# EAGLE design csp_v1 (EAGLE 7.6.0)
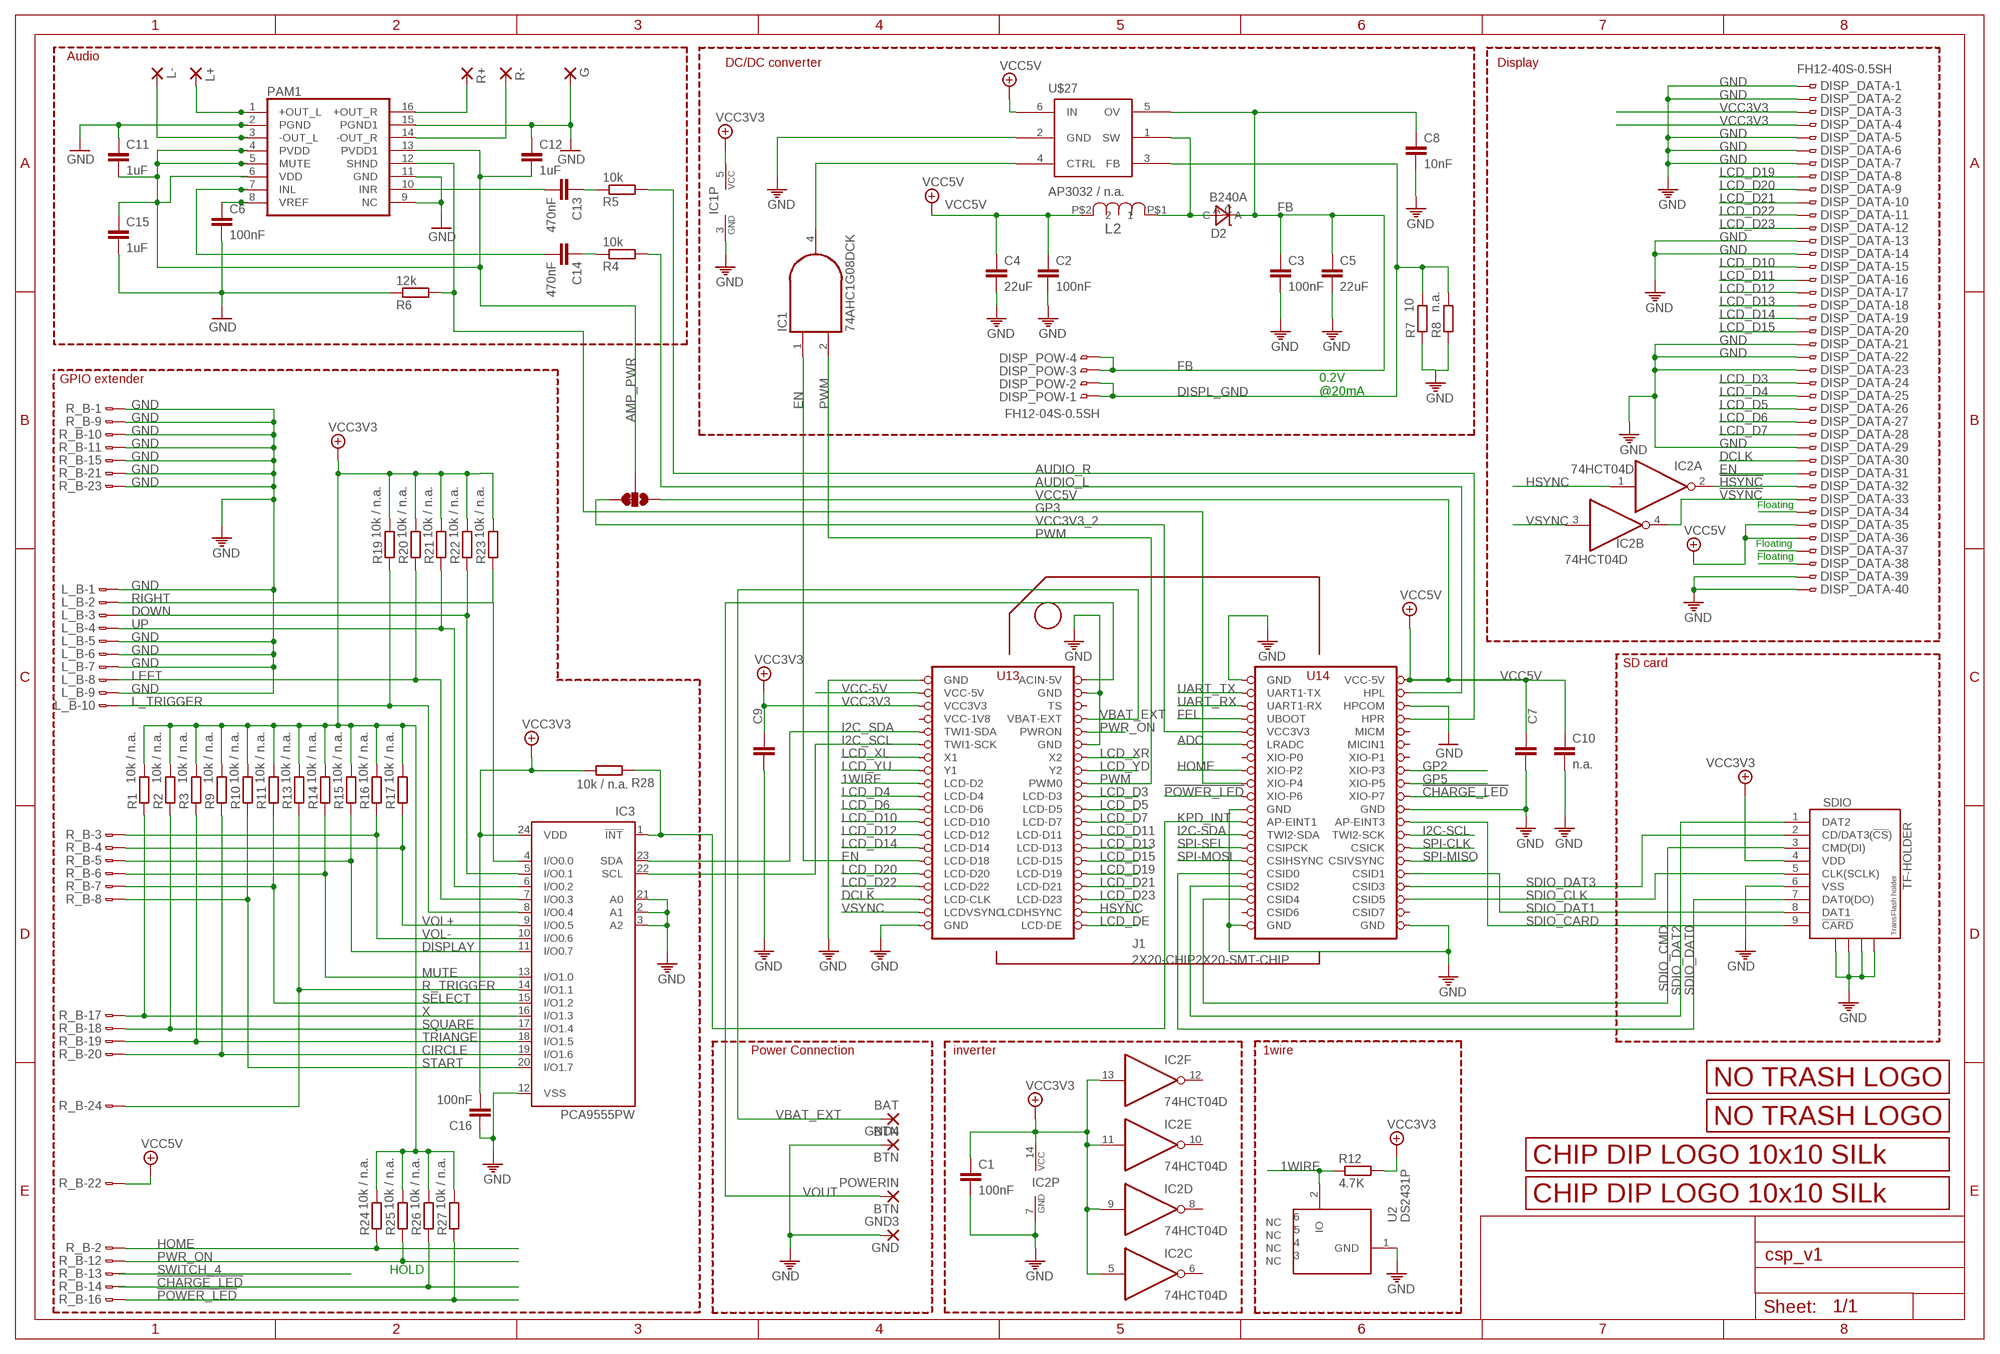
[diagram p0: schematic, sheet 1]

## Parts
BAT  BTN  SMD2  [SMD1,27-2,54]
C1  100nF  C-EUC0805  [C0805]
C2  100nF  C-EUC0805  [C0805]
C3  100nF  C-EUC0805  [C0805]
C4  22uF  C-EUC1206  [C1206]
C5  22uF  C-EUC1206  [C1206]
C6  100nF  C-EUC0805  [C0805]
C7  n.a.  C-EUC0805  [C0805]
C8  10nF  C-EUC0805  [C0805]
C9  n.a.  C-EUC0805  [C0805]
C10  n.a.  C-EUC0805  [C0805]
C11  1uF  C-EUC0805  [C0805]
C12  1uF  C-EUC0805  [C0805]
C13  470nF  C-EUC0805  [C0805]
C14  470nF  C-EUC0805  [C0805]
C15  1uF  C-EUC0805  [C0805]
C16  100nF  C-EUC0805  [C0805]
D2  B240A  DIODE_SCHTKY_B240  [DO-214AC]
DISP_DATA  FH12-40S-0.5SH  [FH12-40S-0.5SH]
DISP_POW  FH12-04S-0.5SH  [FH12-04S-0.5SH]
G  1,6/0,8  [1,6/0,8]
GND3  GND  SMD2  [SMD1,27-2,54]
GND4  BTN  SMD2  [SMD1,27-2,54]
IC1  74AHC1G08DCK  [SC70-5]
IC2  74HCT04D  [SO14]
IC3  PCA9555PW  [TSSOP24]
J1  2X20-CHIP2X20-SMT-CHIP  [2XAWHW40_G_SMD_R]
L2  SRN6045-100M  [SRN6045]
L+  1,6/0,8  [1,6/0,8]
L-  1,6/0,8  [1,6/0,8]
L_B  FH12-10S-0.5SH  [FH12-10S-0.5SH]
PAM1  PAM8403  [SOP-16]
POWERIN  BTN  SMD2  [SMD1,27-2,54]
R1  10k / n.a.  R-EU_M0805  [M0805]
R2  10k / n.a.  R-EU_M0805  [M0805]
R3  10k / n.a.  R-EU_M0805  [M0805]
R4  10k  R-EU_R0805  [R0805]
R5  10k  R-EU_R0805  [R0805]
R6  12k  R-EU_R0805  [R0805]
R7  10  R-EU_M0805  [M0805]
R8  n.a.  R-EU_M0805  [M0805]
R9  10k / n.a.  R-EU_M0805  [M0805]
R10  10k / n.a.  R-EU_M0805  [M0805]
R11  10k / n.a.  R-EU_M0805  [M0805]
R12  4.7K  R-EU_M0805  [M0805]
R13  10k / n.a.  R-EU_M0805  [M0805]
R14  10k / n.a.  R-EU_M0805  [M0805]
R15  10k / n.a.  R-EU_M0805  [M0805]
R16  10k / n.a.  R-EU_M0805  [M0805]
R17  10k / n.a.  R-EU_M0805  [M0805]
R19  10k / n.a.  R-EU_M0805  [M0805]
R20  10k / n.a.  R-EU_M0805  [M0805]
R21  10k / n.a.  R-EU_M0805  [M0805]
R22  10k / n.a.  R-EU_M0805  [M0805]
R23  10k / n.a.  R-EU_M0805  [M0805]
R24  10k / n.a.  R-EU_M0805  [M0805]
R25  10k / n.a.  R-EU_M0805  [M0805]
R26  10k / n.a.  R-EU_M0805  [M0805]
R27  10k / n.a.  R-EU_M0805  [M0805]
R28  10k / n.a.  R-EU_M0805  [M0805]
R+  1,6/0,8  [1,6/0,8]
R-  1,6/0,8  [1,6/0,8]
R_B  FH12-24S-0.5SH  [FH12-24S-0.5SH]
SDIO  TF-HOLDER  [TF-PULL]
SJ3  SMD_SJ_3WAY_CLOSED  [SMD_SJ_3WAY_CLOSED]
U2  DS2431P  [TSOC6]
U$2  LOGO_10X10_SILK  [LOGO2_10X10_SILK]
U$3  LOGO_NO_TRASHROHS  [LOGO_ROHS_SYM]
U$4  LOGO_NO_TRASHNO_TRASH  [LOGO_ROHS_NO_TRASH]
U$5  LOGO_10X10_SILK  [LOGO2_10X10_SILK]
U$27  AP3032 / n.a.  AP3032  [SOT23-6]

## Nets
1WIRE: J1.LCD-D2 R12.1 U2.2(IO)
!CHARGE_LED: J1.XIO-P7 R26.1 R_B.14
!HSYNC: DISP_DATA.32 IC2.2(A:O)
!POWER_LED: J1.XIO-P6 R27.1 R_B.16
!VSYNC: DISP_DATA.33 IC2.4(B:O)
ADC: J1.LRADC
AMP_PWR: C11.2 C12.2 C15.1 PAM1.4(PVDD) PAM1.5(MUTE) PAM1.6(VDD) PAM1.13(PVDD1) SJ3.2
AUDIO_L: J1.HPL R4.2
AUDIO_R: J1.HPR R5.2
CIRCLE: IC3.19(I/O1.6) R9.1 R_B.20
DCLK: DISP_DATA.30 J1.LCD-CLK
DISPL_GND: DISP_POW.1 DISP_POW.2 R7.2 R8.2 U$27.3(FB)
DISPLAY: IC3.11(I/O0.7) R15.1 R_B.5
DOWN: IC3.5(I/O0.1) L_B.3 R22.1
EN: DISP_DATA.31 IC1.1(I0) J1.LCD-D18
FB: C3.1 C5.1 C8.1 D2.C DISP_POW.3 DISP_POW.4 U$27.5(OV)
FEL: J1.FEL(UBOOT)
GND: C1.2 C2.2 C3.2 C4.2 C5.2 C6.2 C7.2 C8.2 C9.2 C10.2 C11.1 C12.1 C15.2 C16.1 DISP_DATA.1 DISP_DATA.2 DISP_DATA.5 DISP_DATA.6 DISP_DATA.7 DISP_DATA.13 DISP_DATA.14 DISP_DATA.21 DISP_DATA.22 DISP_DATA.23 DISP_DATA.29 DISP_DATA.39 DISP_DATA.40 G.1(P) GND3.1(P) GND4.1(P) IC1.3(GND) IC2.7(P:GND) IC3.2(A1) IC3.3(A2) IC3.12(VSS) IC3.21(A0) J1.GND@1(GND) J1.GND@2(GND) J1.GND@3(GND) J1.GND@4(GND) J1.GND@5(GND) J1.GND@6(GND) J1.GND@7(GND) J1.GND@8(GND) J1.GND@10(GND) J1.HPCOM L_B.1 L_B.5 L_B.6 L_B.7 L_B.9 PAM1.2(PGND) PAM1.9(NC) PAM1.11(GND) PAM1.15(PGND1) R6.1 R7.1 R8.1 R_B.1 R_B.9 R_B.10 R_B.11 R_B.15 R_B.21 R_B.23 SDIO.6(VSS) SDIO.S1 SDIO.S2 SDIO.S3 SDIO.S4 U2.1(GND) U$27.2(GND)
GP2: J1.XIO-P3
GP3: J1.XIO-P4 PAM1.12(SHND) R6.2
GP5: J1.XIO-P5
HOME: J1.XIO-P2 R24.1 R_B.2
HSYNC: IC2.1(A:I) J1.LCD-HSYNC(LCDHSYNC)
I2C-SCL: J1.TWI2-SCK
I2C-SDA: J1.TWI2-SDA
I2C_SCL: IC3.22(SCL) J1.TWI1-SCK
I2C_SDA: IC3.23(SDA) J1.TWI1-SDA
INL: C14.2 PAM1.7(INL)
INR: C13.2 PAM1.10(INR)
KPD_INT: IC3.1(!INT) J1.AP-EINT1 R28.1
L+OUT: L+.1(P) PAM1.1(+OUT_L)
L-OUT: L-.1(P) PAM1.3(-OUT_L)
L_TRIGGER: IC3.8(I/O0.4) L_B.10 R19.1
LCD_D3: DISP_DATA.24 J1.LCD-D3
LCD_D4: DISP_DATA.25 J1.LCD-D4
LCD_D5: DISP_DATA.26 J1.LCD-D5
LCD_D6: DISP_DATA.27 J1.LCD-D6
LCD_D7: DISP_DATA.28 J1.LCD-D7
LCD_D10: DISP_DATA.15 J1.LCD-D10
LCD_D11: DISP_DATA.16 J1.LCD-D11
LCD_D12: DISP_DATA.17 J1.LCD-D12
LCD_D13: DISP_DATA.18 J1.LCD-D13
LCD_D14: DISP_DATA.19 J1.LCD-D14
LCD_D15: DISP_DATA.20 J1.LCD-D15
LCD_D19: DISP_DATA.8 J1.LCD-D19
LCD_D20: DISP_DATA.9 J1.LCD-D20
LCD_D21: DISP_DATA.10 J1.LCD-D21
LCD_D22: DISP_DATA.11 J1.LCD-D22
LCD_D23: DISP_DATA.12 J1.LCD-D23
LCD_DE: J1.LCD-DE
LCD_XL: J1.X1
LCD_XR: J1.X2
LCD_YD: J1.Y2
LCD_YU: J1.Y1
LEFT: IC3.7(I/O0.3) L_B.8 R20.1
MUTE: IC3.13(I/O1.0) R14.1 R_B.6
N$1: IC1.4(O) U$27.4(CTRL)
N$9: DISP_DATA.38
N$24: DISP_DATA.37
N$25: DISP_DATA.34
N$38: C6.1 PAM1.8(VREF)
N$41: C14.1 R4.1
N$43: C13.1 R5.1
PWM: IC1.2(I1) J1.PWM0
PWR_ON: J1.PWRON R25.1 R_B.12
R+OUT: PAM1.16(+OUT_R) R+.1(P)
R-OUT: PAM1.14(-OUT_R) R-.1(P)
R_TRIGGER: IC3.14(I/O1.1) R13.1 R_B.24
RIGHT: IC3.4(I/O0.0) L_B.2 R23.1
SDIO_CARD: J1.AP-EINT3 SDIO.9(!CARD)
SDIO_CLK: J1.CSID5 SDIO.5(CLK(SCLK))
SDIO_CMD: J1.CISD4(CSID4) SDIO.3(CMD(DI))
SDIO_DAT0: J1.CSID0 SDIO.7(DAT0(DO))
SDIO_DAT1: J1.CSID1 SDIO.8(DAT1)
SDIO_DAT2: J1.CSID2 SDIO.1(DAT2)
SDIO_DAT3: J1.CSID3 SDIO.2(CD/DAT3(!CS!))
SELECT: IC3.15(I/O1.2) R11.1 R_B.7
SPI-CLK: J1.CSICK
SPI-MISO: J1.CSIVSYNC
SPI-MOSI: J1.CSIHYSYNC(CSIHSYNC)
SPI-SEL: J1.CSPICK(CSIPCK)
SQUARE: IC3.17(I/O1.4) R2.1 R_B.18
START: IC3.20(I/O1.7) R10.1 R_B.8
SWITCH_4: R_B.13
TRIANGE: IC3.18(I/O1.5) R3.1 R_B.19
UART_RX: J1.UART1-RX
UART_TX: J1.UART1-TX
UP: IC3.6(I/O0.2) L_B.4 R21.1
VBAT_EXT: BAT.1(P) J1.BAT(VBAT-EXT)
VCC3V3: C1.1 C9.1 C16.2 DISP_DATA.3 DISP_DATA.4 IC1.5(VCC) IC2.5(C:I) IC2.9(D:I) IC2.11(E:I) IC2.13(F:I) IC2.14(P:VCC) IC3.24(VDD) J1.VCC3V3@2(VCC3V3) R1.2 R2.2 R3.2 R9.2 R10.2 R11.2 R12.2 R13.2 R14.2 R15.2 R16.2 R17.2 R19.2 R20.2 R21.2 R22.2 R23.2 R24.2 R25.2 R26.2 R27.2 R28.2 SDIO.4(VDD)
VCC3V3_2: J1.VCC3V3@1(VCC3V3) SJ3.1
VCC5V: C2.1 C4.1 C7.1 C10.1 DISP_DATA.35 DISP_DATA.36 J1.VCC-5V@2(VCC-5V) L2.P$2 R_B.22 SJ3.3 U$27.6(IN)
VCC-5V: J1.VCC-5V@1(VCC-5V)
VOL+: IC3.9(I/O0.5) R17.1 R_B.4
VOL-: IC3.10(I/O0.6) R16.1 R_B.3
VOUT: J1.CHG-IN(ACIN-5V) POWERIN.1(P)
VREG_OUTPUT: D2.A L2.P$1 U$27.1(SW)
VSYNC: IC2.3(B:I) J1.LCD-VSYNC(LCDVSYNC)
X: IC3.16(I/O1.3) R1.1 R_B.17
Unconnected: IC2.6(C:O) IC2.8(D:O) IC2.10(E:O) IC2.12(F:O) J1.CSID6 J1.CSID7 J1.MICIN1 J1.MICM J1.TS J1.XIO-P0 J1.XIO-P1 U2.3(NC) U2.4(NC) U2.5(NC) U2.6(NC)

## Notes on the sheet
- Audio
- DC/DC converter | Display
- GPIO extender
- 0.2V
  @20mA
- Floating
- Floating
- Floating
- SD card
- Power Connection | inverter | 1wire
- HOLD

## Power pins joined to a net without a drawn wire
VCC-1V8: J1.VCC1V8(VCC-1V8)

## Library data of the parts
BAT GND3 GND4 POWERIN = wirepad:SMD2: SMD PAD
C1-C16 = rcl:C-EU: CAPACITOR, European symbol
D2 = Keyboard v0_5:DIODE_SCHTKY_B240; DESCRIPTION: DIODE SMD General Purpose 400V 1A 1.4W RoHS DO-214AC; FOOTPRINT: DO-214AC; LINK: http://www.digikey.com/product-detail/en/B240A-13-F/B240A-FDICT-ND/717810; MFG: DIGIKEY; MFG_PN: B240A-FDICT-ND; PART_TYPE: DIODE; PRICE: 0.11; VENDOR: DIODES; VENDOR_PART_NUMBER: B240A-13-F
DISP_DATA = Keyboard v0_5:FH12-40S-0.5S: 0.5mm Pitch Connectors For FPC/FFC Source: Data sheet <http://www.hirose.co.jp/cataloge_hp/e58605370.pdf>; DESCRIPTION: CON ffc smd, bottom contact 40pos, 0.50mm R/A; FOOTPRINT: FH12-40S-0.5SH; LINK: http://www.digikey.com/product-detail/en/FH12-40S-0.5SH(55)/HFJ140CT-ND/1110388; MFG: DIGIKEY; MFG_PN: HFJ140CT-ND; VENDOR: HIROSE; VENDOR_PART_NUMBER: FH12-40S-0.5SH(55)
DISP_POW = JKW_CHIP:FH12-04S-0.5S: 0.5mm Pitch Connectors For FPC/FFC Source: Data sheet <http://www.hirose.co.jp/cataloge_hp/e58605370.pdf>; MPN: FH12-10S-0.5SH(55); OC_FARNELL: 1324540; OC_NEWARK: 34M6152
G L+ L- R+ R- = wirepad:1,6/0,8: THROUGH-HOLE PAD
IC1 = 74xx-little-us:74*1G08: 2-input AND gate
IC2 = JKW_CHIP:74*04: Hex INVERTER
IC3 = micro-philips:PCA9555: 16-bit I2C and SMBus I/O port with interrupt Source: PCA9555_5.pdf; MPN: PCA9555PW; OC_FARNELL: 1408297; OC_NEWARK: 63K6069
J1 = JKW_CHIP:2X20-CHIP: Chip header
L2 = Keyboard v0_5:SRN6045-100M; DESCRIPTION: power inductor 10uH 2.5A 58.6 mohm; FOOTPRINT: SRN6045; LINK: http://www.digikey.com/product-detail/en/SRN6045-100M/SRN6045-100MTR-ND/2756120; MFG: DIGIKEY; MFG_PN: SRN6045-100MTR-ND; PART_TYPE: IND; PRICE: 0.15; TOLLERANCE: ±20%; VENDOR: BOURNS; VENDOR_PART_NUMBER: SRN6045-100M
L_B = con-hirose:FH12-10S-0.5S: 0.5mm Pitch Connectors For FPC/FFC Source: Data sheet <http://www.hirose.co.jp/cataloge_hp/e58605370.pdf>; MPN: FH12-10S-0.5SH(55); OC_FARNELL: 1324540; OC_NEWARK: 34M6152
PAM1 = JKW_CHIP:PAM8403: Dual channel audio amplifier IC - PAM8403
R1-R17 R19-R28 = rcl:R-EU_: RESISTOR, European symbol
R_B = con-hirose:FH12-24S-0.5S: 0.5mm Pitch Connectors For FPC/FFC Source: Data sheet <http://www.hirose.co.jp/cataloge_hp/e58605370.pdf>; MPN: FH12-24S-0.5SH(55); OC_FARNELL: 1324552; OC_NEWARK: 34M6170
SDIO = JKW_CHIP:TF-HOLDER: TF / Micro SD socket is PUSH-PUSH type, the card can be pushed into and auto locked and pushed out by simply press the card. Surface Mounting type.
SJ3 = JKW_CHIP:SMD_SJ_3WAY_CLOSED
U2 = JKW_CHIP:DS2431: 1024-Bit EEPROM This chip provides a 4x256 Bit EEPROM, which can be programmed@5V. Write protection and OTP emulation are available, too. Author: Jan Kandziora <jjj@gmx.de>; DESCRIPTION: IC, 1024-Bit, 1-Wire EEPROM, TSOC6; FOOTPRINT: TSOC6; LINK: http://www.digikey.com/product-detail/en/DS2431P%2BT%26R/DS2431P%2BT%26RCT-ND/3647900; MFG: DIGIKEY; MFG_PN: DS2431P+T&RCT-ND; PART_TYPE: IC; PRICE: 0.98; VENDOR: MAXIM; VENDOR_PART_NUMBER: DS2431P+T&R
U$2 U$5 = JKW_CHIP:LOGO_10X10_SILK
U$3 U$4 = JKW_CHIP:LOGO_NO_TRASH
U$27 = JKW_CHIP:AP3032

## Board
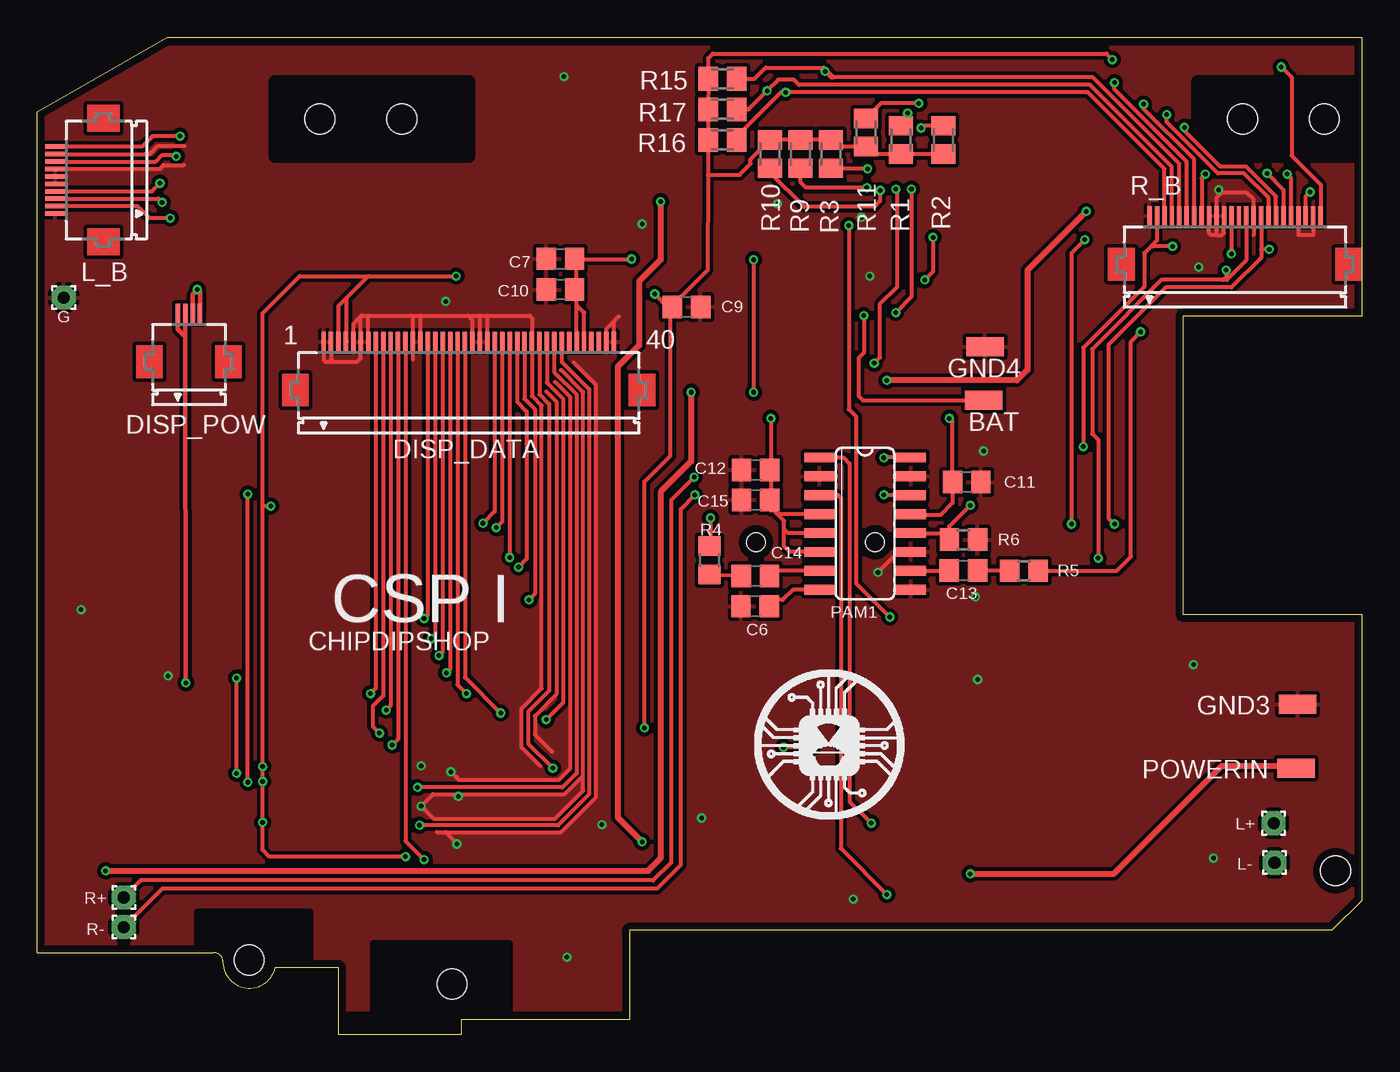
[diagram p1: board, top side]
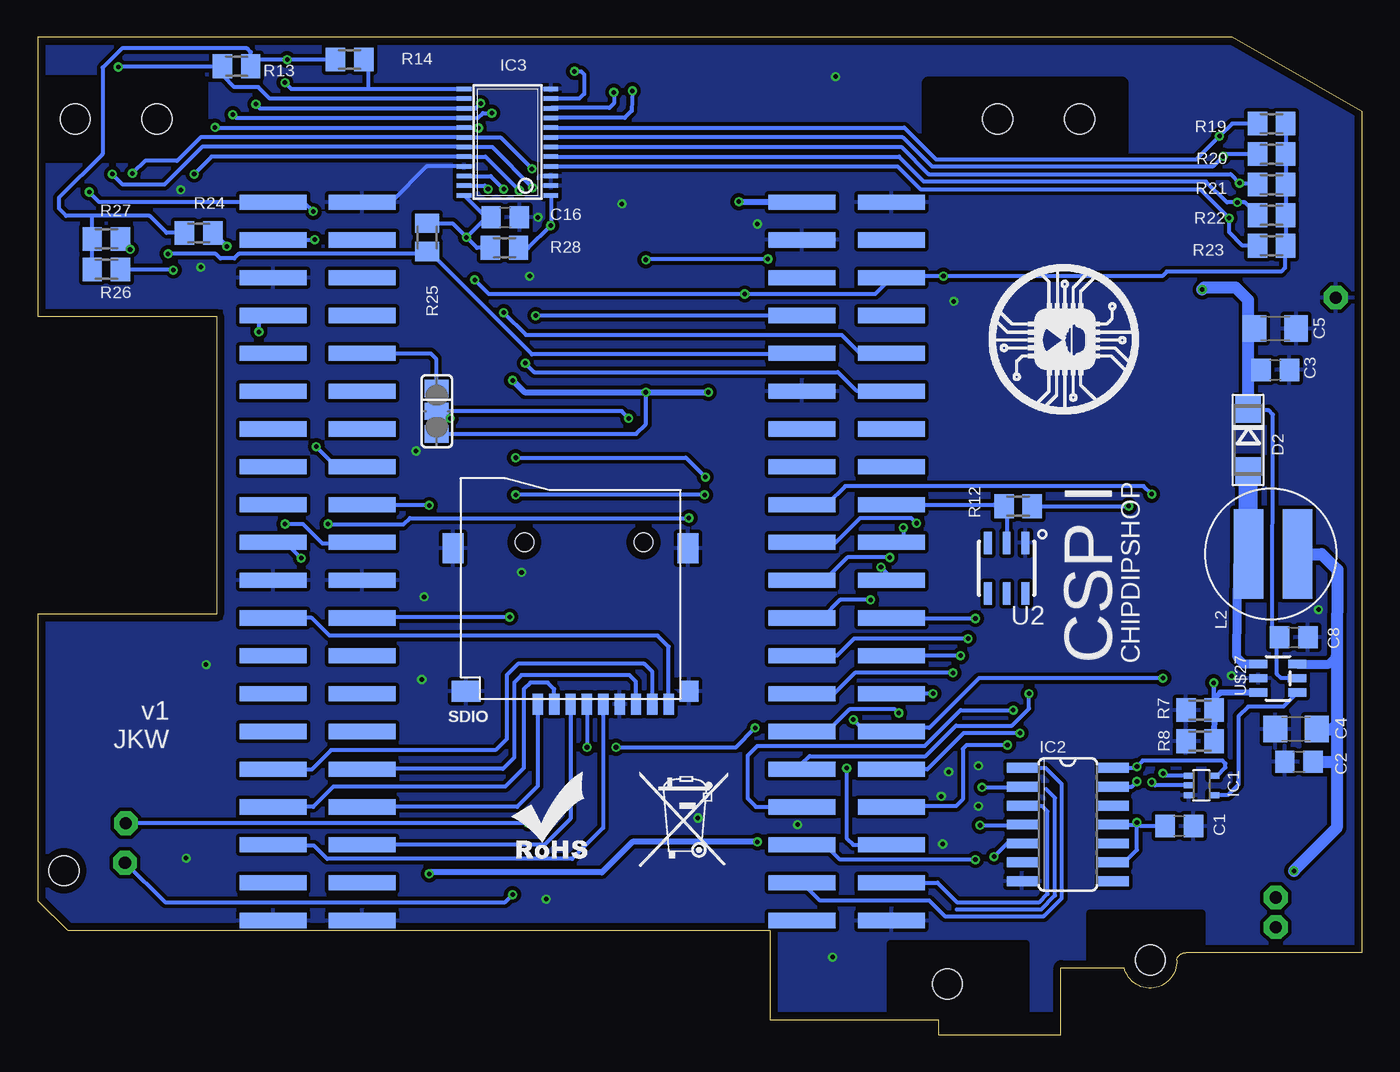
[diagram p2: board, bottom side, seen from below]

Size 89 x 67 mm. Coordinates in mm from the lower left corner, seen from the top.
Outline: 39.8,1 28.5,1 28.5,0 20.25,0 20.25,4.5 16,4.5 arc-170 12.47,5 arc80 11.85,5.5 0,5.5 0,62 8.75,67 89,67 89,48.25 77,48.25 77,28.25 89,28.25 89,9 87,7 39.8,7 39.8,1
Copper layers (1*16): Top 0.035mm / dielectric 1.6mm / Bottom 0.035mm
Design rules "Elecrow_2-layer_PCB_eagle_rule": minimum track width 6mil, minimum drill 12mil, track to track 6mil, track to pad 6mil, pad to pad 6mil, via to via 8mil, smd to smd 0mil, copper to edge 20mil, drill to drill 10mil, minimum pad ring 6mil, minimum via ring 6mil, stop-mask expansion 0mil, vias tented up to drill 100mil, thermal gap 10mil
Holes 2 mm at 27.88,3.39 14.25,5 19,61.5 86.5,61.5 81,61.5 24.5,61.5 87.25,11
bKeepout: area 14.4,3.2 to 20.6,65.1
tRestrict: area 16,59 to 29,64; area 78,59 to 88.6,64; area 22.6,1.3 to 31.7,6.1; area 10.8,2.9 to 18.3,8.2
bRestrict: area 16.1,58.9 to 29.1,63.9; area 78,59 to 88.6,64; area 10.8,2.8 to 18.3,8.2; area 22.6,1.3 to 31.7,6.1

### Footprints (pad centres in the part's own frame; a part is rotated, then mirrored left to right if it is on the bottom)
SMD1,27-2,54 = smd 1.27 x 2.54: 1 0,0
C0805 = smd 1.3 x 1.5: 1 -0.95,0; 2 0.95,0
C1206 = smd 1.6 x 1.8: 1 -1.4,0; 2 1.4,0
DO-214AC = smd 1.8 x 1.7: A 2.05,0; C -2.05,0
FH12-40S-0.5SH = smd 0.3 x 1.3: 1 -9.75,3.25; 2 -9.25,3.25; 3 -8.75,3.25; 4 -8.25,3.25; 5 -7.75,3.25; 6 -7.25,3.25; 7 -6.75,3.25; 8 -6.25,3.25; 9 -5.75,3.25; 10 -5.25,3.25; 11 -4.75,3.25; 12 -4.25,3.25; 13 -3.75,3.25; 14 -3.25,3.25; 15 -2.75,3.25; 16 -2.25,3.25; 17 -1.75,3.25; 18 -1.25,3.25; 19 -0.75,3.25; 20 -0.25,3.25; 21 0.25,3.25; 22 0.75,3.25; 23 1.25,3.25; 24 1.75,3.25; 25 2.25,3.25; 26 2.75,3.25; 27 3.25,3.25; 28 3.75,3.25; 29 4.25,3.25; 30 4.75,3.25; 31 5.25,3.25; 32 5.75,3.25; 33 6.25,3.25; 34 6.75,3.25; 35 7.25,3.25; 36 7.75,3.25; 37 8.25,3.25; 38 8.75,3.25; 39 9.25,3.25; 40 9.75,3.25
FH12-04S-0.5SH = smd 0.3 x 1.3: 1 -0.75,3.25; 2 -0.25,3.25; 3 0.25,3.25; 4 0.75,3.25
1,6/0,8 = drill 0.813 pad 1.6 octagon: 1 0,0
SC70-5 = smd 0.4 x 0.7: 1 -0.65,-0.85; 2 0,-0.85; 3 0.65,-0.85; 4 0.65,0.85; 5 -0.65,0.85
SO14 = smd 0.66 x 2.032: 1 -3.81,-3.073; 2 -2.54,-3.073; 3 -1.27,-3.073; 4 0,-3.073; 5 1.27,-3.073; 6 2.54,-3.073; 7 3.81,-3.073; 8 3.81,3.073; 9 2.54,3.073; 10 1.27,3.073; 11 0,3.073; 12 -1.27,3.073; 13 -2.54,3.073; 14 -3.81,3.073
TSSOP24 = smd 0.305 x 0.991: 1 -3.575,-2.918; 2 -2.925,-2.918; 3 -2.275,-2.918; 4 -1.625,-2.918; 5 -0.975,-2.918; 6 -0.325,-2.918; 7 0.325,-2.918; 8 0.975,-2.918; 9 1.625,-2.918; 10 2.275,-2.918; 11 2.925,-2.918; 12 3.575,-2.918; 13 3.575,2.918; 14 2.925,2.918; 15 2.275,2.918; 16 1.625,2.918; 17 0.975,2.918; 18 0.325,2.918; 19 -0.325,2.918; 20 -0.975,2.918; 21 -1.625,2.918; 22 -2.275,2.918; 23 -2.925,2.918; 24 -3.575,2.918
2XAWHW40_G_SMD_R = smd 4.5 x 1.02 bottom: AP-EINT1 35.1,21.59; AP-EINT3 41.1,21.59; BAT 5.54,41.91; CHG-IN 5.54,49.53; CISD4 35.1,6.35; CSICK 41.1,16.51; CSID0 35.1,11.43; CSID1 41.1,11.43; CSID2 35.1,8.89; CSID3 41.1,8.89; CSID5 41.1,6.35; CSID6 35.1,3.81; CSID7 41.1,3.81; CSIHYSYNC 35.1,13.97; CSIVSYNC 41.1,13.97; CSPICK 35.1,16.51; FEL 35.1,41.91; GND@1 -0.46,49.53; GND@2 5.54,46.99; GND@3 5.54,36.83; GND@4 -0.46,1.27; GND@5 41.1,1.27; GND@6 35.1,1.27; GND@7 41.1,24.13; GND@8 35.1,24.13; GND@10 35.1,49.53; HPCOM 41.1,44.45; HPL 41.1,46.99; HPR 41.1,41.91; LCD-CLK -0.46,6.35; LCD-D2 -0.46,29.21; LCD-D3 5.54,26.67; LCD-D4 -0.46,26.67; LCD-D5 5.54,24.13; LCD-D6 -0.46,24.13; LCD-D7 5.54,21.59; LCD-D10 -0.46,21.59; LCD-D11 5.54,19.05; LCD-D12 -0.46,19.05; LCD-D13 5.54,16.51; LCD-D14 -0.46,16.51; LCD-D15 5.54,13.97; LCD-D18 -0.46,13.97; LCD-D19 5.54,11.43; LCD-D20 -0.46,11.43; LCD-D21 5.54,8.89; LCD-D22 -0.46,8.89; LCD-D23 5.54,6.35; LCD-DE 5.54,1.27; LCD-HSYNC 5.54,3.81; LCD-VSYNC -0.46,3.81; LRADC 35.1,36.83; MICIN1 41.1,36.83; MICM 41.1,39.37; PWM0 5.54,29.21; PWRON 5.54,39.37; TS 5.54,44.45; TWI1-SCK -0.46,36.83; TWI1-SDA -0.46,39.37; TWI2-SCK 41.1,19.05; TWI2-SDA 35.1,19.05; UART1-RX 35.1,44.45; UART1-TX 35.1,46.99; VCC1V8 -0.46,41.91; VCC3V3@1 35.1,39.37; VCC3V3@2 -0.46,44.45; VCC-5V@1 -0.46,46.99; VCC-5V@2 41.1,49.53; X1 -0.46,34.29; X2 5.54,34.29; XIO-P0 35.1,34.29; XIO-P1 41.1,34.29; XIO-P2 35.1,31.75; XIO-P3 41.1,31.75; XIO-P4 35.1,29.21; XIO-P5 41.1,29.21; XIO-P6 35.1,26.67; XIO-P7 41.1,26.67; Y1 -0.46,31.75; Y2 5.54,31.75
SRN6045 = smd 2 x 6: P$1 1.5,0; P$2 -1.8,0
FH12-10S-0.5SH = smd 0.3 x 1.3: 1 -2.25,3.25; 2 -1.75,3.25; 3 -1.25,3.25; 4 -0.75,3.25; 5 -0.25,3.25; 6 0.25,3.25; 7 0.75,3.25; 8 1.25,3.25; 9 1.75,3.25; 10 2.25,3.25
SOP-16 = smd 0.66 x 2.032: 1 -4.445,-3.073; 2 -3.175,-3.073; 3 -1.905,-3.073; 4 -0.635,-3.073; 5 0.635,-3.073; 6 1.905,-3.073; 7 3.175,-3.073; 8 4.445,-3.073; 9 4.445,3.073; 10 3.175,3.073; 11 1.905,3.073; 12 0.635,3.073; 13 -0.635,3.073; 14 -1.905,3.073; 15 -3.175,3.073; 16 -4.445,3.073
M0805 = smd 1.3 x 1.6: 1 -0.95,0; 2 0.95,0
R0805 = smd 1.3 x 1.5: 1 -0.95,0; 2 0.95,0
FH12-24S-0.5SH = smd 0.3 x 1.3: 1 -5.75,3.25; 2 -5.25,3.25; 3 -4.75,3.25; 4 -4.25,3.25; 5 -3.75,3.25; 6 -3.25,3.25; 7 -2.75,3.25; 8 -2.25,3.25; 9 -1.75,3.25; 10 -1.25,3.25; 11 -0.75,3.25; 12 -0.25,3.25; 13 0.25,3.25; 14 0.75,3.25; 15 1.25,3.25; 16 1.75,3.25; 17 2.25,3.25; 18 2.75,3.25; 19 3.25,3.25; 20 3.75,3.25; 21 4.25,3.25; 22 4.75,3.25; 23 5.25,3.25; 24 5.75,3.25
TF-PULL = smd 0.7 x 1.4: 1 -2.2,-7.62; 2 -1.1,-7.62; 3 0,-7.62; 4 1.1,-7.62; 5 2.2,-7.62; 6 3.3,-7.62; 7 4.4,-7.62; 8 5.5,-7.62; 9 6.6,-7.62 | smd 1.4 x 2: S1 -7.9,2.85; S2 7.9,2.85 | smd 1.28 x 1.4: S3 7.96,-6.75 | smd 1.95 x 1.4: S4 -7.025,-6.75 | hole 1.25: -3.1,3.25; 4.9,3.25
SMD_SJ_3WAY_CLOSED = smd 1.168 x 1.6: 1 -1.524,0; 2 0,0; 3 1.524,0
TSOC6 = smd 0.53 x 1.53: 1 -1.27,-1.7; 2 0,-1.7; 3 1.27,-1.7; 4 1.27,1.7; 5 0,1.7; 6 -1.27,1.7
SOT23-6 = smd 0.559 x 1.219: 1 -0.95,-1.3; 2 0,-1.3; 3 0.965,-1.3; 4 0.965,1.321; 5 0,1.3; 6 -0.95,1.321

### Placement (x,y rotation side)
BAT  63.6,42.6 90 top
C1  12.3,14 0 bottom
C2  4.26,18.32 180 bottom
C3  5.85,44.65 0 bottom
C4  4.45,20.52 180 bottom
C5  5.85,47.43 0 bottom
C6  48.25,28.78 180 top
C7  35.16,52.11 180 top
C8  4.6,26.68 0 bottom
C9  43.63,48.88 0 top
C10  35.16,50.05 180 top
C11  62.47,37.11 180 top
C12  48.28,37.93 0 top
C13  62.24,31.18 180 top
C14  48.26,30.81 0 top
C15  48.28,35.91 180 top
C16  57.6,54.9 180 bottom
D2  7.68,39.95 270 bottom
DISP_DATA  29,43.3 0 top
DISP_POW  10.2,45.2 0 top
G  1.78,49.51 0 top
GND3  84.7,22.2 90 top
GND4  63.7,46.2 90 top
IC1  10.81,16.74 270 bottom
IC2  19.79,14.11 270 bottom
IC3  57.45,59.95 90 bottom
J1  32.1,6.39 0 top
L2  6.15,32.28 180 bottom
L+  83.09,14.2 0 top
L-  83.15,11.55 0 top
L_B  4.45,57.4 90 top
PAM1  55.64,34.33 270 top
POWERIN  84.6,17.9 90 top
R1  58.05,60.1 270 top
R2  60.9,60.1 270 top
R3  53.35,59.15 90 top
R4  45.18,31.86 90 top
R5  66.31,31.16 0 top
R6  62.25,33.25 180 top
R7  10.9,21.8 0 bottom
R8  10.9,19.7 0 bottom
R9  51.3,59.15 90 top
R10  49.25,59.15 90 top
R11  55.7,60.6 270 top
R12  23.13,35.5 0 bottom
R13  75.65,65.05 0 bottom
R14  68.05,65.5 180 bottom
R15  46.05,64.2 180 top
R16  46.05,60.1 180 top
R17  46.05,62.15 180 top
R19  6.1,61.2 0 bottom
R20  6.1,59.15 0 bottom
R21  6.1,57.1 0 bottom
R22  6.1,55.05 0 bottom
R23  6.1,53 0 bottom
R24  78.2,53.85 180 bottom
R25  62.85,53.55 90 bottom
R26  84.4,51.4 180 bottom
R27  84.4,53.45 180 bottom
R28  57.65,52.85 180 bottom
R+  5.82,9.21 0 top
R-  5.82,7.22 0 top
R_B  80.5,51.75 0 top
SDIO  53.21,29.82 0 bottom
SJ3  62.2,41.88 270 bottom
U2  23.9,31.33 180 bottom
U$2  48.2,14.46 0 top
U$3  57.63,11.76 0 bottom
U$4  48.62,11.27 0 bottom
U$5  15.04,41.68 90 bottom
U$27  5.68,23.94 270 bottom

### Tracks (layer width: path | path; a pad name or v marks a point on that pad's centre or on a via)
1WIRE
  Bottom 0.254: J1.LCD-D2 24.75,35.6 24.2,35.05 | 24.2,35.05 23.9,34.75 23.9,33.53 U2.2 | R12.1 24.08,35.17 24.2,35.05
!CHARGE_LED  (via drill 0.3)
  Top 0.254: R_B.14 81.25,52 79.95,50.7 79.7,50.7 | 79.7,50.7 75.55,50.7 70.9,46.05 70.9,40.35 71.3,39.95 v71.3,32 | v79.9,51.35 79.9,50.9 79.7,50.7
  Bottom 0.254: J1.XIO-P7 73.11,33.15 72.45,33.15 72.55,33.05 72.35,33.05 v71.3,32 | R26.1 79.95,51.4 v79.9,51.35
!HSYNC  (via drill 0.3)
  Top 0.254: DISP_DATA.32 34.75,44.5 36.25,43 36.25,17.55 35.3,16.6 v25.55,16.6
  Bottom 0.254: v25.55,16.6 22.91,16.6 IC2.2
!POWER_LED  (via drill 0.3)
  Top 0.254: R_B.16 82.25,52.75 | 82.25,52.75 82.25,52.2 80.25,50.2 75.85,50.2 72,46.35 72,34.7 v72.4,34.3 | v82.8,52.75 82.25,52.75
  Bottom 0.254: v72.4,34.3 71.2,34.3 69.9,33 67.26,33 | R27.1 v82.8,52.75
  Bottom 0.406: 67.26,33 67.2,33 J1.XIO-P6
!VSYNC  (via drill 0.3)
  Top 0.254: DISP_DATA.33 35.25,45.21 37.1,43.36 37.1,16.15 35.01,14.06 v25.69,14.06
  Bottom 0.254: v25.69,14.06 22.91,14.06 IC2.4
AMP_PWR  (via drill 0.3)
  Top 0.254: PAM1.13 58.77,34.9 60.7,34.9 61.52,35.72 C11.2 61.52,41.18 v61.3,41.4 | v49.3,41.4 49.3,37.9 | 49.3,37.9 49.3,35.9 | 49.3,35.9 49.3,35.4 | 49.3,35.4 49.3,35.2 | 52.65,34.95 52.64,34.96 PAM1.4 49.74,34.96 | PAM1.5 50.46,33.69 50.2,33.95 | 50.2,33.95 50.2,34.5 49.74,34.96 | PAM1.6 50.58,32.42 50.2,32.8 50.2,33.95 | 49.74,34.96 49.3,35.4 | C15.1 49.29,35.91 49.3,35.9 | C12.2 49.27,37.93 49.3,37.9
  Bottom 0.254: v49.3,41.4 49.77,41.88 SJ3.2 61.73,41.4 v61.3,41.4
AUDIO_L  (via drill 0.3)
  Top 0.254: v70.4,53.4 69.5,52.5 v69.5,34.3 | v45.25,34.7 45.25,32.88 R4.2
  Bottom 0.254: J1.HPL 70.42,53.38 v70.4,53.4 | v69.5,34.3 69.45,34.25 64.45,34.25 64,34.7 v45.25,34.7
AUDIO_R  (via drill 0.3)
  Top 0.254: R5.2 72.56,31.16 73.5,32.1 73.5,46.55 v74.15,47.2
  Bottom 0.254: v74.15,47.2 74.15,47.8 73.75,48.2 73.3,48.2 J1.HPR
CIRCLE  (via drill 0.3)
  Top 0.254: v84,57.8 84.25,57.55 R_B.20 | v55.75,56.9 51.65,56.9 51.3,57.25 R9.1
  Bottom 0.254: v84,57.8 83.3,57.1 80.5,57.1 77.97,59.62 IC3.19 58.48,59.62 v55.75,56.9
DCLK  (via drill 0.3)
  Top 0.254: DISP_DATA.30 33.75,43 34.4,42.35 34.4,23.1 33,21.7 33,19.55 v34.65,17.9
  Bottom 0.254: v34.65,17.9 34.65,13.2 34.2,12.75 J1.LCD-CLK
DISPL_GND  (via drill 0.3)
  Top 0.305: DISP_POW.2 9.95,46.89 | 9.95,46.89 v9.99,23.63 | DISP_POW.1 9.45,47.39 9.95,46.89
  Bottom 0.305: v9.99,23.63 9.99,21.64 R7.2
  Bottom 0.406: U$27.3 9.54,22.98 9.91,22.61 9.91,21.71 R7.2 9.98,19.79 R8.2
DISPLAY  (via drill 0.3)
  Top 0.254: R_B.5 76.75,58.5 70.95,64.3 53.5,64.3 | 53.5,64.3 53.35,64.3 v52.95,64.7 | R15.1 48.2,64.2 48.95,64.95 52.85,64.95 53.5,64.3
  Bottom 0.254: v52.95,64.7 52.5,64.7 52.3,64.5 52.3,63.2 52.62,62.88 IC3.11
DOWN  (via drill 0.3)
  Top 0.254: L_B.3 8.15,56.15 v8.4,55.9
  Bottom 0.254: IC3.5 31.12,58.98 29.45,57.3 10.5,57.3 9.1,55.9 v8.4,55.9 7.9,55.9 R22.1
EN  (via drill 0.3)
  Top 0.254: DISP_DATA.31 34.25,43.8 35.35,42.7 35.35,22.3 v34.2,21.15 | v13.4,17.55 v13.4,23.95
  Bottom 0.254: v34.2,21.15 33.41,20.36 J1.LCD-D18 31.4,20.6 29.1,20.6 25.75,23.95 v13.4,23.95 | IC1.1 13.24,17.39 v13.4,17.55
FB  (via drill 0.3)
  Top 0.305: DISP_POW.4 10.95,49.86 v10.76,50.05 10.45,49.74 DISP_POW.3
  Bottom 0.254: U$27.5 5.45,23.94 5.73,24.22 5.73,26.59 6.05,26.91 6.01,41.64 6.3,41.93 7.61,41.93 D2.C | C5.1 7.65,47.43 7.68,47.45 | C3.1 6.8,44.75 7.68,44.75
  Bottom 0.813: D2.C 7.68,44.75 7.68,47.45 7.68,49.34 8.51,50.17 10.64,50.17 v10.76,50.05 | C8.1 5.64,26.59 5.73,26.59
GND  (via drill 0.3)
  Top 0.254: DISP_DATA.40 38.75,47.91 | 38.75,47.91 39.08,48.24 | DISP_DATA.39 38.25,47.41 38.75,47.91 | 27.45,13.6 35.2,13.6 37.55,15.95 37.55,43.65 36.05,45.15 | 36.65,17.35 35.45,16.15 26.6,16.15 v25.8,15.35 26.68,14.47 34.77,14.47 36.69,16.39 36.69,43.16 35.2,44.65 | 34.2,43.2 34.9,42.5 34.9,22.85 33.45,21.4 33.45,20.15 34.6,19 | 33.8,18.05 32.55,19.3 32.55,21.9 33.9,23.25 33.9,42.25 33.25,42.9 DISP_DATA.29 33.25,48.15 33.1,48.3 30.25,48.3 | DISP_DATA.5 21.25,47.75 21.75,48.25 | DISP_DATA.6 21.75,48.25 | 21.75,48.25 21.8,48.3 | DISP_DATA.6 21.75,48.2 21.85,48.3 22.25,48.3 | 22.25,48.3 25.1,48.3 | 25.1,48.3 25.75,48.3 | 25.75,48.3 28.95,48.3 | 28.95,48.3 29.75,48.3 | 29.75,48.3 30.25,48.3 | DISP_DATA.23 30.25,48.3 | DISP_DATA.22 29.75,48.3 | DISP_DATA.21 29.25,48 28.95,48.3 | DISP_DATA.14 25.75,48.3 | 25.1,48.3 25.25,48.15 DISP_DATA.13 25.25,45.35 | DISP_DATA.7 22.25,48.3 | DISP_DATA.2 19.75,45.35 19.9,45.2 | 19.9,45.2 21.5,45.2 21.75,45.45 DISP_DATA.6 | DISP_DATA.1 19.25,45.3 19.35,45.2 19.9,45.2 | R_B.23 85.75,53.7 84.75,53.7 R_B.21 | 79.3,53.7 78.9,53.7 78.75,53.85 R_B.9 | 79.3,53.7 79.25,53.75 R_B.10 79.25,56.2 79.6,56.55 | 81.75,53.7 R_B.15 81.75,56.1 81.3,56.55 79.6,56.55 | 79.3,53.7 79.6,53.7 79.75,53.85 R_B.11 | L_B.9 7.55,59.15 8.1,59.7 9.9,59.7 | L_B.7 8.25,58.15 8.5,58.4 9.85,58.4 | 26.85,13.6 27.45,13.6 | 27.45,13.6 28.2,12.85 | 79.6,56.55 v79.4,56.75 | PAM1.11 57.87,32.42 v56.5,31.05 | 34.8,43.85 35.8,42.85 35.8,17.85 35.05,17.1 28.35,17.1 28.2,17.25 28.2,17.3 27.85,17.65
  Bottom 0.254: IC3.21 62.88,58.33 65.28,55.92 J1.GND@10
  other vias: 40.65,54.45 27.45,49.25 63.6,39.2 63.05,29.4 63.2,23.85 54.85,9.1 79.05,11.85 77.7,24.85 28.2,12.8 25.8,18.05 27.8,17.65 8.8,24.1 2.95,28.55 78.05,51.55 49.75,55.8 55.95,50.95 55.4,54.9 35.4,64.35 28.3,16 37.95,14.1 44.65,14.55 35.6,5.2
  pour Bottom (isolate 0.254): 0.45,61.55 8.8,66.4 88.6,66.4 88.6,63.9 88.6,48.85 79.4,48.85 76.45,48.85 76.45,47.05 76.45,27.7 88.45,27.7 88.45,9.2 86.75,7.5 39.5,7.5 39.5,1.65 20.7,1.65 20.7,4.75 13.15,4.75 13.15,5.85 0.45,5.85 0.45,6.65
  pour Top (isolate 0.254): 0.45,61.55 8.8,66.4 88.6,66.4 88.6,63.9 88.6,48.85 79.4,48.85 76.45,48.85 76.45,47.05 76.45,27.7 88.45,27.7 88.45,9.2 86.75,7.5 39.5,7.5 39.5,1.65 20.7,1.65 20.7,4.75 13.15,4.75 13.15,5.85 0.45,5.85 0.45,6.65
GP3  (via drill 0.3)
  Top 0.254: PAM1.12 60.86,33.69 R6.2 61.3,34.15 v62.7,35.55
  Bottom 0.254: v62.7,35.55 67.15,35.55 J1.XIO-P4
HOME  (via drill 0.3)
  Top 0.254: R_B.2 75.25,53.35 74.9,53 | 74.9,53 74.4,52.5 74.4,50.25 70.3,46.15 v70.3,39.5 | v76.3,52.95 74.95,52.95 74.9,53
  Bottom 0.254: J1.XIO-P2 68.95,38.15 v70.3,39.5 | R24.1 77.2,53.85 v76.3,52.95
HSYNC
  Bottom 0.254: IC2.1 21.3,17.92 20.2,16.82 20.2,9.15 21.4,7.95 28.05,7.95 29.1,9 36.44,9 J1.LCD-HSYNC
I2C_SCL  (via drill 0.3)
  Top 0.254: v56.25,45.1 56.65,45.5 56.65,49.1 57.8,50.25 57.8,56.7 v57.7,56.8
  Bottom 0.254: v56.25,45.1 55.65,44.5 35.25,44.5 34,43.25 31.67,43.25 J1.TWI1-SCK | IC3.22 58.58,57.67 v57.7,56.8
I2C_SDA  (via drill 0.3)
  Top 0.254: v58.75,56.8 58.75,49.55 v57.7,48.5
  Bottom 0.254: IC3.23 58.98,57.02 v58.75,56.8 | v57.7,48.5 56.2,47 35,47 33.76,45.76 J1.TWI1-SDA
INL
  Top 0.254: PAM1.7 49.27,31.15 C14.2
INR
  Top 0.254: PAM1.10 61.26,31.15 C13.2
KPD_INT  (via drill 0.3)
  Top 0.254: v54.55,54.35 54.55,42 55.05,41.5 55.05,30.3 v57.3,28.05
  Bottom 0.254: IC3.1 54.53,54.37 v54.55,54.35 56.05,52.85 R28.1 | v57.3,28.05 67.13,28.05 J1.AP-EINT1
L+OUT  (via drill 0.3)
  Top 0.254: PAM1.1 54.18,38.77 54.6,38.35 54.6,15.65 v56.05,14.2
  Bottom 0.254: v56.05,14.2 82.99,14.2 L+.1
L-OUT  (via drill 0.3)
  Top 0.254: v57.1,9.4 54,12.5 54,36.05 53.82,36.23 PAM1.3
  Bottom 0.254: L-.1 80.45,8.9 57.6,8.9 v57.1,9.4
L_TRIGGER  (via drill 0.3)
  Top 0.254: v9.6,60.35 7.75,60.35 7.05,59.65 L_B.10
  Bottom 0.254: IC3.8 30.77,60.92 28.65,58.8 11.15,58.8 v9.6,60.35 8.75,61.2 R19.1
LCD_D3  (via drill 0.3)
  Top 0.254: DISP_DATA.24 30.75,35.15 v29.95,34.35
  Bottom 0.254: v29.95,34.35 30.3,34.7 33.75,34.7 35.4,33.05 37.63,33.05 J1.LCD-D3
LCD_D4  (via drill 0.3)
  Top 0.254: DISP_DATA.25 31.25,34.45 v30.85,34.05
  Bottom 0.254: v30.85,34.05 30.85,33.2 31,33.05 31.63,33.05 J1.LCD-D4
LCD_D5  (via drill 0.3)
  Top 0.254: DISP_DATA.26 v31.75,32.05
  Bottom 0.254: v31.75,32.05 34.6,32.05 36.13,30.52 J1.LCD-D5
LCD_D6  (via drill 0.3)
  Top 0.254: DISP_DATA.27 32.25,42.5 32.9,41.85 32.9,31.95 v32.35,31.4
  Bottom 0.254: v32.35,31.4 31.64,30.69 J1.LCD-D6
LCD_D7  (via drill 0.3)
  Top 0.254: DISP_DATA.28 32.75,42.7 33.45,42 33.45,29.6 v33.05,29.2
  Bottom 0.254: v33.05,29.2 35.1,29.2 36.32,27.98 J1.LCD-D7
LCD_D10  (via drill 0.3)
  Top 0.254: DISP_DATA.15 26.25,28.2 v26,27.95
  Bottom 0.254: v26,27.95 31.61,27.95 J1.LCD-D10
LCD_D11  (via drill 0.3)
  Top 0.254: DISP_DATA.16 26.75,26.85 v26.5,26.6
  Bottom 0.254: v26.5,26.6 34.15,26.6 35.3,25.45 J1.LCD-D11
LCD_D12  (via drill 0.3)
  Top 0.254: DISP_DATA.17 27.25,25.7 v27,25.45
  Bottom 0.254: v27,25.45 J1.LCD-D12
LCD_D13  (via drill 0.3)
  Top 0.254: DISP_DATA.18 27.75,24.55 v27.5,24.3
  Bottom 0.254: v27.5,24.3 34.1,24.3 35.5,22.9 J1.LCD-D13
LCD_D14  (via drill 0.3)
  Top 0.254: DISP_DATA.19 28.25,23.5 v28.85,22.9
  Bottom 0.254: v28.85,22.9 J1.LCD-D14
LCD_D15  (via drill 0.3)
  Top 0.254: DISP_DATA.20 28.75,24 v31.15,21.6
  Bottom 0.254: v31.15,21.6 31.4,21.85 34.45,21.85 35.94,20.36 J1.LCD-D15
LCD_D19  (via drill 0.3)
  Top 0.254: DISP_DATA.8 22.75,23.25 v22.4,22.9
  Bottom 0.254: J1.LCD-D19 37.64,18.21 37.15,18.7 29.35,18.7 27.3,20.75 23.55,20.75 22.4,21.9 v22.4,22.9
LCD_D20  (via drill 0.3)
  Top 0.254: DISP_DATA.9 23.25,22.75 22.55,22.05 22.55,20.7 v23,20.25
  Bottom 0.254: v23,20.25 26.8,20.25 29.23,17.82 J1.LCD-D20
LCD_D21  (via drill 0.3)
  Top 0.254: DISP_DATA.10 23.75,22.1 v23.45,21.8
  Bottom 0.254: J1.LCD-D21 37.66,15.3 40.75,15.3 41.3,15.85 41.3,18.75 40.65,19.4 29.4,19.4 27,21.8 v23.45,21.8
LCD_D22  (via drill 0.3)
  Top 0.254: DISP_DATA.11 24.25,19.85 v23.85,19.45
  Bottom 0.254: v23.85,19.45 26.6,19.45 26.85,19.2 26.85,15.8 27.3,15.35 31.57,15.35 J1.LCD-D22
LCD_D23  (via drill 0.3)
  Top 0.254: DISP_DATA.12 24.75,13 v26,11.75
  Bottom 0.254: v26,11.75 35.1,11.75 36.1,12.75 J1.LCD-D23
LEFT  (via drill 0.3)
  Top 0.254: L_B.8 7.95,58.65 8.4,59.1 9.25,59.1 v9.35,59
  Bottom 0.254: IC3.7 30.88,60.27 28.9,58.3 10.05,58.3 9.7,58.65 v9.35,59 9.2,59.15 R20.1
MUTE  (via drill 0.3)
  Top 0.254: R_B.6 77.25,58.65 72.4,63.5 v72.4,63.95
  Bottom 0.254: v72.4,63.95 71.97,63.52 66.85,63.52 | 66.85,63.52 IC3.13 | R14.1 66.7,65.5 66.8,65.4 66.8,63.58 66.85,63.52
N$1
  Bottom 0.254: U$27.4 5.31,22.03 7.67,22.03 8.32,21.38 8.32,16.79 9.03,16.08 IC1.4
N$27
  Bottom 0.254: 21.25,16.5 20.65,15.9 20.65,9.35 21.6,8.4 27.25,8.4
N$38
  Top 0.254: PAM1.8 50.78,29.88 50.1,29.2 49.18,29.2 C6.1
N$41
  Top 0.254: R4.1 47.28,30.83 C14.1
N$43
  Top 0.254: C13.1 65.33,31.18 R5.1
PWM  (via drill 0.3)
  Top 0.254: v14.15,16.95 v14.15,36.3
  Bottom 0.254: IC1.2 13.94,16.74 v14.15,16.95 | v14.15,36.3 14.7,36.85 34.75,36.85 35.95,35.65 37.59,35.65 J1.PWM0
PWR_ON  (via drill 0.3)
  Top 0.254: R_B.12 v80.25,52.45
  Bottom 0.254: J1.PWRON 37.7,45.7 55.8,45.7 62.55,52.45 62.9,52.45 | R25.1 62.9,52.45 | 62.9,52.45 75.5,52.45 75.8,52.15 76.75,52.15 77.05,52.45 v80.25,52.45
R+OUT  (via drill 0.3)
  Top 0.254: PAM1.16 56.92,38.77 v56.9,38.75 | v44.15,37.45 42.6,35.9 42.6,11.55 41.4,10.35 6.96,10.35 R+.1
  Bottom 0.254: v56.9,38.75 45.45,38.75 v44.15,37.45
R-OUT  (via drill 0.3)
  Top 0.254: v44.2,36.25 43.25,35.3 43.25,11.4 41.65,9.8 8.4,9.8 R-.1 | v56.9,36.25 58.69,36.25 PAM1.14
  Bottom 0.254: v44.2,36.25 v56.9,36.25
R_TRIGGER  (via drill 0.3)
  Top 0.254: v83.6,65 84.3,64.3 84.3,59.05 86.25,57.1 R_B.24
  Bottom 0.254: IC3.14 73.42,62.88 74.2,63.65 75.8,63.65 76.5,64.35 76.5,64.95 R13.1 76.65,65 v83.6,65
RIGHT  (via drill 0.3)
  Top 0.254: v8.95,54.85 7.55,54.85 6.75,55.65 L_B.2
  Bottom 0.254: IC3.4 31.23,58.33 29.7,56.8 10.9,56.8 v8.95,54.85 8.95,53.9 8.05,53 R23.1
SDIO_CARD
  Bottom 0.254: SDIO.9 46.61,26.06 47.35,26.8 69.4,26.8 70.6,28 73.18,28 J1.AP-EINT3
SDIO_CLK
  Bottom 0.254: SDIO.5 51.01,13.89 53.1,11.8 69.55,11.8 70.45,12.7 73.16,12.7 J1.CSID5
SDIO_CMD
  Bottom 0.254: SDIO.3 53.21,14.49 54.96,12.74 J1.CISD4
SDIO_DAT0
  Bottom 0.254: SDIO.7 48.81,23.71 49.25,24.15 56.5,24.15 57,23.65 57,18.6 57.75,17.85 67.17,17.85 J1.CSID0
SDIO_DAT1
  Bottom 0.254: SDIO.8 47.71,24.36 48.25,24.9 56.75,24.9 57.5,24.15 57.5,19.85 58.25,19.1 69.3,19.1 70.6,17.8 73.18,17.8 J1.CSID1
SDIO_DAT2
  Bottom 0.254: SDIO.1 55.41,16.69 56.8,15.3 66.35,15.3 66.45,15.2 67.12,15.2 J1.CSID2
SDIO_DAT3
  Bottom 0.254: SDIO.2 54.31,23.21 54.75,23.65 55.9,23.65 56.35,23.2 56.35,17.9 57.6,16.65 69.15,16.65 70.5,15.3 73.18,15.3 J1.CSID3
SELECT  (via drill 0.3)
  Top 0.254: R_B.7 77.75,58.8 74.35,62.2 v74.35,62.5 | v59.25,62.55 56.7,62.55 R11.1
  Bottom 0.254: v74.35,62.5 74.08,62.23 IC3.15 59.58,62.23 v59.25,62.55
SQUARE  (via drill 0.3)
  Top 0.254: R_B.18 83.25,56.3 81.25,58.3 79.5,58.3 77.1,60.7 v77.1,60.95 | R2.1 59.55,61.05 v59.4,60.9
  Bottom 0.254: v77.1,60.95 77.08,60.92 IC3.17 59.42,60.92 v59.4,60.9
START  (via drill 0.3)
  Top 0.254: v78.5,57.8 78.25,57.55 R_B.8 | v56.65,56.7 56.65,56 56.25,55.6 51.55,55.6 49.25,57.9 R10.1
  Bottom 0.254: v78.5,57.8 77.33,58.98 IC3.20 58.92,58.98 v56.65,56.7
TRIANGE  (via drill 0.3)
  Top 0.254: v82.65,57.85 83.75,56.75 R_B.19 | v55.8,58.15 53.4,58.15 R3.1
  Bottom 0.254: v82.65,57.85 81.8,58.7 79.65,58.7 78.08,60.27 IC3.18 57.92,60.27 v55.8,58.15
UP  (via drill 0.3)
  Top 0.254: L_B.4 7.7,56.65 v8.25,57.2
  Bottom 0.254: R21.1 7.15,57.2 v8.25,57.2 8.85,57.8 29.15,57.8 30.98,59.62 IC3.6
VBAT_EXT  (via drill 0.3)
  Top 0.254: v55.55,48.3 55.55,45.8 55.2,45.45 55.2,42.9 55.5,42.6 BAT.1
  Bottom 0.254: J1.BAT 53.5,48.3 v55.55,48.3
VCC3V3  (via drill 0.3)
  Top 0.254: 20.79,49.49 20.25,48.95 DISP_DATA.3 | 20.79,49.49 22.25,50.95 | 22.25,50.95 v28.15,50.95 | v24.75,11.95 15.6,11.95 15.15,12.4 v15.15,14.25 v15.15,17 v15.15,18 15.15,35.5 | 15.15,35.5 15.15,48.45 17.65,50.95 22.25,50.95 | v15.7,35.5 15.15,35.5 | v40.8,20.6 40.8,37.15 42.55,38.9 42.55,48.7 42.48,48.77 | 42.48,48.77 v41.5,49.75 | R15.2 45.09,62.1 | 45.09,62.1 45.08,60 | 45.08,60 45.08,57.75 | 45.08,57.75 45.05,51.35 42.65,48.95 | 42.65,48.95 42.48,48.77 | v60.2,53.55 60.2,51.25 v59.65,50.7 | C9.1 42.69,48.91 42.65,48.95 | v52.1,19.3 v50.15,19.3 | R15.2 45.1,65.6 45.4,65.9 71.85,65.9 v72.25,65.5 | R1.2 R2.2 56.2,59.15 R11.2 53.8,59.65 R3.2 R9.2 R10.2 47.95,58.8 47.95,58.5 47.2,57.75 45.08,57.75 | R15.2 45.05,64.2 | R17.2 45.09,62.1 | R16.2 45.08,60.08 45.08,60 | DISP_DATA.4 20.79,46.55 20.79,49.49
  Bottom 0.254: IC2.5 23.86,12.84 v24.75,11.95 | IC2.11 15.29,14.11 v15.15,14.25 | IC2.13 15.5,16.65 v15.15,17 | IC2.14 15.23,17.92 v15.15,18 14.75,18.4 9.4,18.4 9.2,18.2 9.2,17.95 9.76,17.39 IC1.5 | R12.2 v15.7,35.5 | R19.2 R20.2 R21.2 R22.2 R23.2 5.2,52.95 5.2,51.5 5.45,51.25 13.15,51.25 13.45,50.95 v28.15,50.95 30.85,50.95 31.05,50.75 31.55,50.75 J1.VCC3V3@2 32.73,49.75 v41.5,49.75 58.7,49.75 v59.65,50.7 | 58.7,54.5 58.95,54.5 C16.2 | C16.2 58.89,54.9 IC3.24 | SDIO.4 v52.11,19.31 v52.1,19.3 | R28.2 59.5,52.85 v60.2,53.55 | v60.2,53.55 58.85,54.9 C16.2 | R25.2 61.15,54.5 v60.2,53.55 | v50.15,19.3 42.1,19.3 v40.8,20.6 | C1.1 14.9,14 v15.15,14.25 | R24.2 80.35,53.85 81.5,55 85.4,55 | 85.4,55 87.1,55 87.6,55.5 87.6,56.2 84.65,59.15 84.65,64.95 83.35,66.25 74.95,66.25 74.7,66 R13.2 74.25,65.5 v72.25,65.5 R14.2 | R26.2 R27.2 85.35,54.95 85.4,55 | IC2.9 15.98,11.57 15.15,12.4 v15.15,14.25
VCC3V3_2
  Bottom 0.254: J1.VCC3V3@1 62.61,45.76 62.25,45.4 62.25,43.45 SJ3.1
VCC5V  (via drill 0.3)
  Top 0.254: R_B.22 85.25,56.3 v85.55,56.6 | 36.55,50.05 C10.1 36.25,50.05 | 36.24,52.11 C7.1 36.12,52.1 | DISP_DATA.35 36.25,49 | 36.25,49 36.25,50.05 | 36.25,50.05 36.25,51.98 36.12,52.1 | DISP_DATA.36 36.75,48.5 36.25,49 | 36.12,52.1 v39.95,52.1 | v48.15,52.05 v48.15,43.15
  Top 0.406: v70.5,55.3 66.55,51.35 66.55,44.65 65.85,43.95 v57.1,43.95 | v43.95,43.15 43.95,38.5 41.9,36.45 41.9,11.85 41.05,11 v4.6,11
  Bottom 0.254: v85.55,56.6 84.87,55.92 J1.VCC-5V@2 73.16,55.96 71.16,55.96 v70.5,55.3 | v39.95,52.1 48.1,52.1 v48.15,52.05 | SJ3.3 48.8,40.35 48.15,41 v48.15,43.15
  Bottom 0.406: v57.1,43.95 56.3,43.15 v48.15,43.15 v43.95,43.15
  Bottom 0.61: U$27.6 2.24,24.89 1.72,25.41
  Bottom 0.813: L2.P$2 2.73,32.28 1.68,31.23 1.72,25.41 1.72,20.8 | 1.72,20.8 1.72,18.3 | 1.72,18.3 1.72,13.88 v4.6,11 | C4.1 2,20.52 1.72,20.8 | C2.1 1.75,18.32 1.72,18.3
VOL+  (via drill 0.3)
  Top 0.254: R_B.4 76.25,58.3 70.75,63.8 51.2,63.8 50.85,64.15 49.8,64.15 v49.05,63.4 | 48.95,63.5 v49.05,63.4 | R17.1 47.8,62.15 v49.05,63.4
  Bottom 0.254: v49.05,63.4 49.1,62.05 49.58,61.58 IC3.9
VOL-  (via drill 0.3)
  Top 0.254: R_B.3 75.75,58.15 70.6,63.3 v50.3,63.3 50,63.3 47,60.3 R16.1
  Bottom 0.254: v50.3,63.3 50.3,62.55 50.6,62.25 54.51,62.25 IC3.10
VOUT  (via drill 0.3)
  Top 0.406: v41.9,55.95 41.9,52.05 40.45,50.6 40.45,46.3 39,44.85 39,14.6 v40.65,12.95 | v62.7,10.8 72.35,10.8 79.6,18.05 84.45,18.05 POWERIN.1
  Bottom 0.254: 41.87,55.92 v41.9,55.95
  Bottom 0.406: J1.CHG-IN 41.87,55.92 | v40.65,12.95 49.05,12.95 51.1,10.9 62.6,10.9 v62.7,10.8
VREG_OUTPUT
  Bottom 0.61: U$27.1 7.96,24.89 8.42,25.35 8.38,31.55 L2.P$1
  Bottom 1.27: L2.P$1 7.65,37.5 D2.A
VSYNC
  Bottom 0.254: J1.LCD-VSYNC 28.55,10.2 27.25,8.9 21.7,8.9 21.15,9.45 21.15,15 21.5,15.35 22.83,15.35 IC2.3
X  (via drill 0.3)
  Top 0.254: R_B.17 82.75,56.2 81.1,57.85 79.35,57.85 75.9,61.3 v75.9,61.8 | R1.1 58.05,61.45 v58.5,61.9
  Bottom 0.254: v75.9,61.8 75.67,61.58 IC3.16 59.42,61.58 59.1,61.9 v58.5,61.9

### Text on the board
tNames: 1 | 40 | CSP I | CHIPDIPSHOP
bNames: CHIPDIPSHOP | CSP I | v1 / JKW